# Altium schematic sheet Sensor_Connector.SchDoc: ToF Sensor Connector
size A4; DrawnBy: Samyar Sadat Akhavi; Revision: 1.0; SheetNumber: 2; SheetTotal: 2
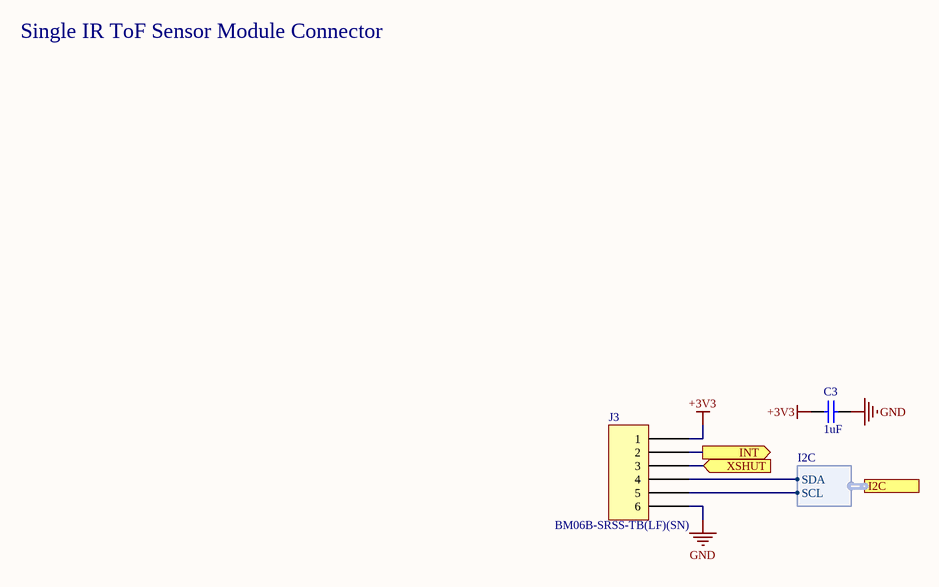
[diagram p0: Sensor_Connector.SchDoc]

## Parts
?  (no value)  (graphical)
C3  1uF  [CAP_SMD_603]
J3  BM06B-SRSS-TB(LF)(SN)  [JST BM06B-SRSS-TB]

## Ports
I2C (harness I2C, see ToF_Sensor_Hub[3B]), INT (out, see ToF_Sensor_Hub[3B]), XSHUT (in, see ToF_Sensor_Hub[3B])

## Harnesses
I2C: SDA, SCL

## Nets
+3V3: C3.2 J3.1
GND: C3.1 J3.6
INT: J3.2 ; port INT
XSHUT: J3.3 ; port XSHUT
NetJ3_4: J3.4 ; port I2C.SDA
NetJ3_5: J3.5 ; port I2C.SCL

## Notes on the sheet
- Single IR ToF Sensor Module Connector
- Sub-Project:
- Size:
- Drawn By:
- Revision:
- Date:
- File:
- Sheet:
- of

## Library data of the parts
? = Standard Title Block
C3 = Non-polar Capacitor: Generic Ceramic Capacitor; Voltage: 6.3V; Value: 1uF
J3 = BM06B-SRSS-TB(LF)(SN): CONN HEADER SMD 6POS 1MM; Manufacturer: JST Sales America Inc.; Current Rating (Amps): 0.7A; Material Flammability Rating: UL94 V-0; Number of Positions: 6; Number of Positions Loaded: All; Pitch - Mating: 0.039" (1.00mm); Shrouding: Shrouded - 4 Wall; Style: Board to Cable/Wire; Voltage Rating: 50V; System: Connector; Part Number: BM06B-SRSS-TB(LF)(SN); ComponentLink1Description: Datasheet; ComponentLink1URL: http://www.jst-mfg.com/product/pdf/eng/eSH.pdf; ComponentLink2Description: DigiKey Link; ComponentLink2URL: http://digikey.com/product-detail/en/jst-sales-america-inc/BM06B-SRSS-TB-LF-SN/455-1792-1-ND/926863; Connector Type: Header; Contact Finish - Mating: Tin; Contact Finish - Post: Tin; Contact Material: Copper Alloy; Contact Shape: Square; Contact Type: Male Pin; Fastening Type: Push-Pull; Features: Solder Retention; Insulation Color: Natural; Insulation Height: 0.167" (4.25mm); Insulation Material: Polyamide (PA), Nylon; LastUpdated: 1/12/2020 10:14:30 PM; Lifecycle Status: Active; Minimum Order: 1; Mounting Type: Surface Mount; Number of Rows: 1; Operating Temperature: -25°C ~ 85°C; Packaging: TapeAndReel; PartId: 20; Part Status: Active; Price: 0.38; Series: SR; Supplier 1: DigiKey; Supplier Part Number 1: 455-1792-1-ND; Termination: Solder